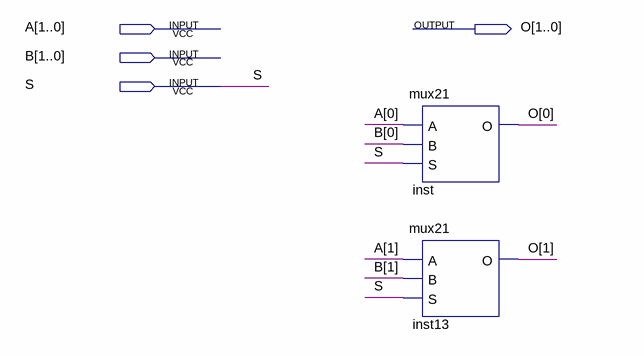
[diagram p0: schematic sheet]
// Quartus schematic mux21_2bit.bdf as structural Verilog: 2 symbols, 4 pins
module mux21_2bit (
  input  [1:0] A,
  input  [1:0] B,
  input  S,
  output [1:0] O
);

  mux21 inst (.A(A[0]), .B(B[0]), .S(S), .O(O[0]));
  mux21 inst13 (.A(A[1]), .B(B[1]), .S(S), .O(O[1]));
endmodule
